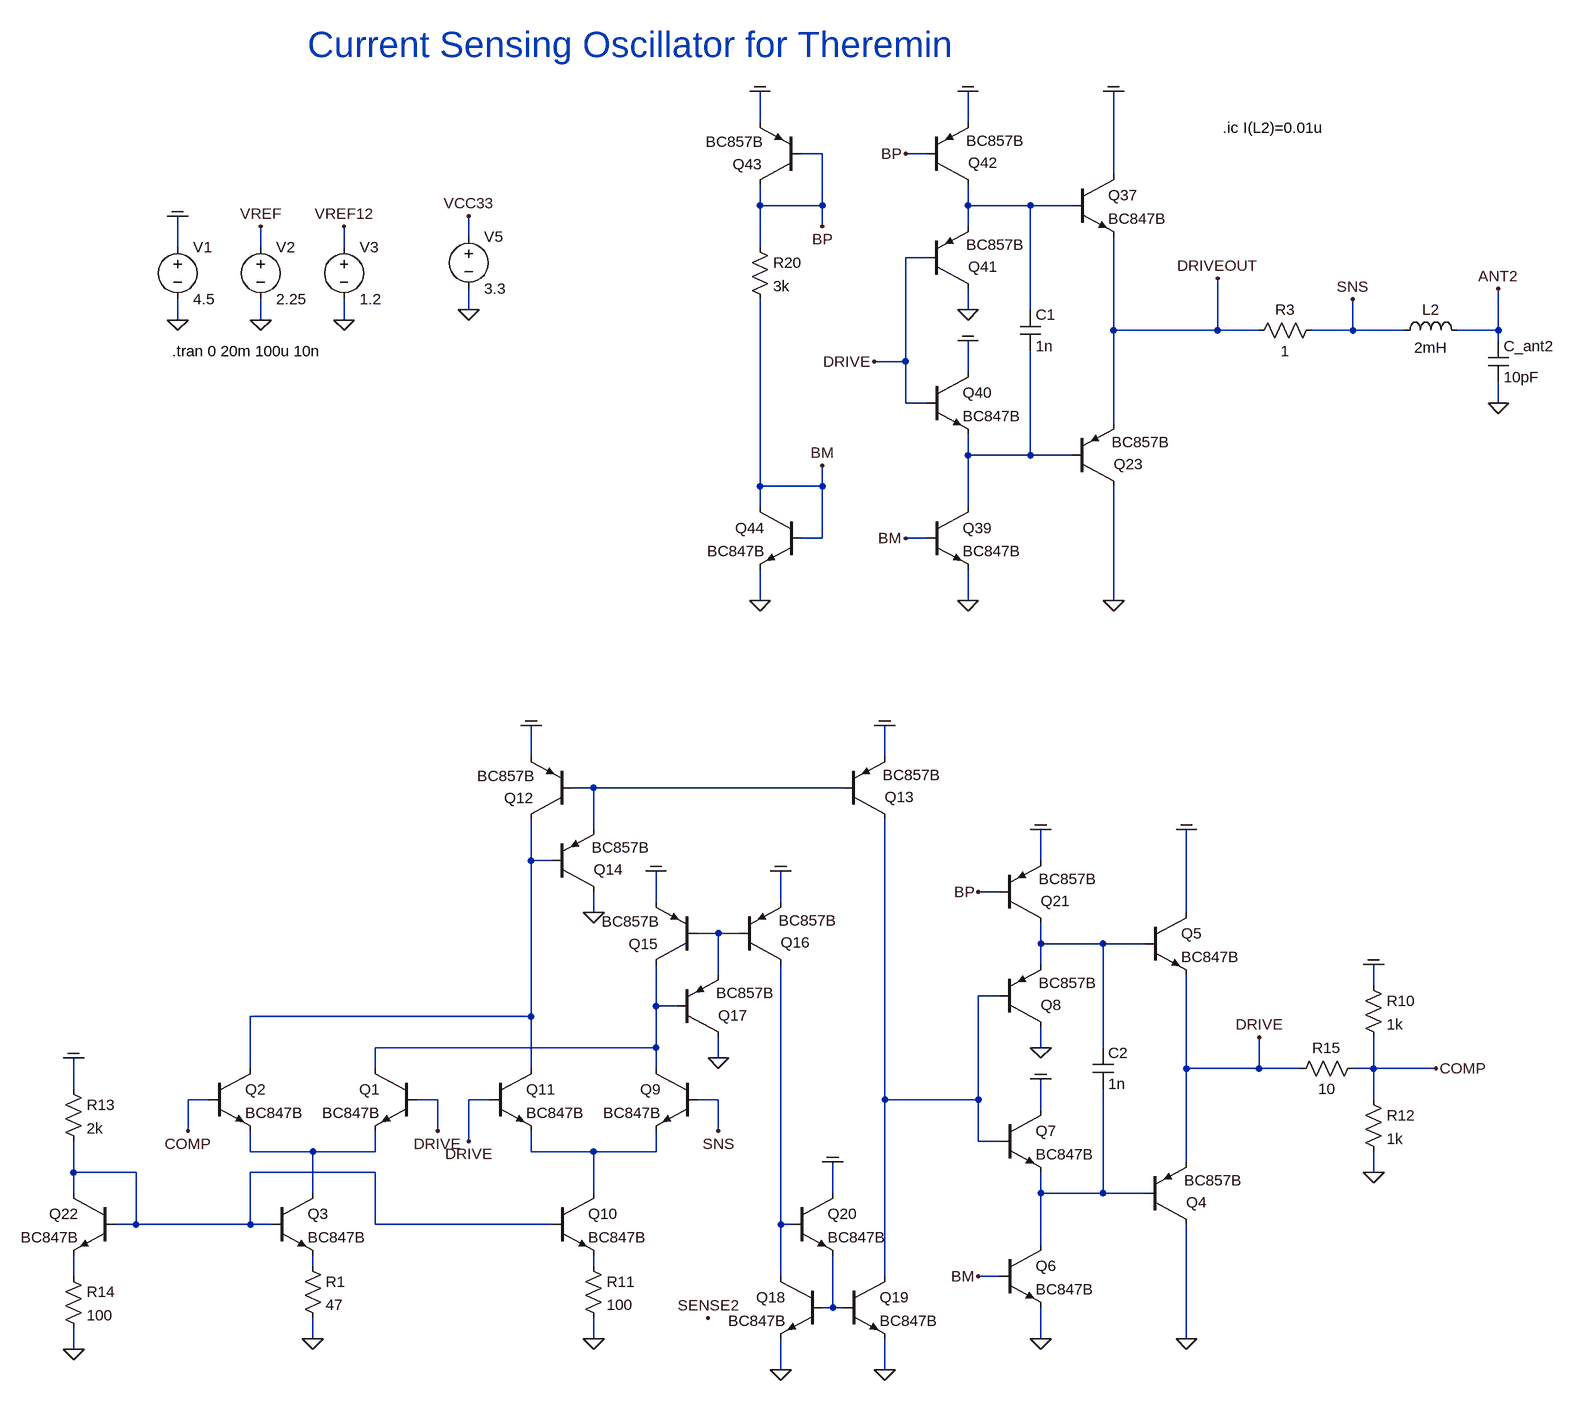
[diagram p0: schematic current_sensing_osc_v01.asc]
current_sensing_osc_v01.asc, the LTspice schematic file:
Version 4
SHEET 1 4012 2536
WIRE 1456 -160 1456 -208
WIRE 1776 -160 1776 -208
WIRE 1552 -112 1520 -112
WIRE 1712 -112 1680 -112
WIRE 2000 -80 2000 -208
WIRE 1456 -32 1456 -64
WIRE 1552 -32 1552 -112
WIRE 1552 -32 1456 -32
WIRE 1776 -32 1776 -64
WIRE 1872 -32 1776 -32
WIRE 1936 -32 1872 -32
WIRE 1552 0 1552 -32
WIRE 1776 0 1776 -32
WIRE 1008 16 1008 -16
WIRE 560 32 560 -16
WIRE 688 32 688 0
WIRE 816 32 816 0
WIRE 1456 32 1456 -32
WIRE 1712 48 1680 48
WIRE 1008 128 1008 96
WIRE 1776 128 1776 96
WIRE 1872 128 1872 -32
WIRE 560 144 560 112
WIRE 688 144 688 112
WIRE 816 144 816 112
WIRE 2000 160 2000 16
WIRE 2160 160 2160 80
WIRE 2160 160 2000 160
WIRE 2224 160 2160 160
WIRE 2368 160 2368 112
WIRE 2368 160 2304 160
WIRE 2448 160 2368 160
WIRE 2592 160 2592 96
WIRE 2592 160 2528 160
WIRE 2592 176 2592 160
WIRE 1680 208 1680 48
WIRE 1680 208 1632 208
WIRE 1776 224 1776 176
WIRE 1680 272 1680 208
WIRE 1712 272 1680 272
WIRE 2592 272 2592 240
WIRE 2000 304 2000 160
WIRE 1776 352 1776 320
WIRE 1872 352 1872 192
WIRE 1872 352 1776 352
WIRE 1936 352 1872 352
WIRE 1456 400 1456 112
WIRE 1552 400 1552 368
WIRE 1552 400 1456 400
WIRE 1456 432 1456 400
WIRE 1776 432 1776 352
WIRE 1552 480 1552 400
WIRE 1552 480 1520 480
WIRE 1712 480 1680 480
WIRE 1456 576 1456 528
WIRE 1776 576 1776 528
WIRE 2000 576 2000 400
WIRE 1104 816 1104 768
WIRE 1648 816 1648 768
WIRE 1200 864 1168 864
WIRE 1584 864 1200 864
WIRE 1200 928 1200 864
WIRE 1104 976 1104 912
WIRE 1136 976 1104 976
WIRE 1888 976 1888 928
WIRE 1824 1024 1792 1024
WIRE 1296 1040 1296 992
WIRE 1488 1040 1488 992
WIRE 1200 1056 1200 1024
WIRE 2112 1056 2112 928
WIRE 1392 1088 1360 1088
WIRE 1424 1088 1392 1088
WIRE 1888 1104 1888 1072
WIRE 1984 1104 1888 1104
WIRE 2048 1104 1984 1104
WIRE 1888 1136 1888 1104
WIRE 1392 1152 1392 1088
WIRE 2400 1168 2400 1136
WIRE 1824 1184 1792 1184
WIRE 1296 1200 1296 1136
WIRE 1328 1200 1296 1200
WIRE 1104 1216 1104 976
WIRE 1104 1216 672 1216
WIRE 1296 1264 1296 1200
WIRE 1296 1264 864 1264
WIRE 1888 1264 1888 1232
WIRE 1984 1264 1984 1104
WIRE 1392 1280 1392 1248
WIRE 672 1296 672 1216
WIRE 864 1296 864 1264
WIRE 1104 1296 1104 1216
WIRE 1296 1296 1296 1264
WIRE 2112 1296 2112 1152
WIRE 2224 1296 2224 1248
WIRE 2224 1296 2112 1296
WIRE 2288 1296 2224 1296
WIRE 2400 1296 2400 1248
WIRE 2400 1296 2368 1296
WIRE 2496 1296 2400 1296
WIRE 400 1328 400 1280
WIRE 608 1344 576 1344
WIRE 960 1344 928 1344
WIRE 1040 1344 1008 1344
WIRE 1392 1344 1360 1344
WIRE 1648 1344 1648 912
WIRE 1792 1344 1792 1184
WIRE 1792 1344 1648 1344
WIRE 2400 1344 2400 1296
WIRE 1888 1360 1888 1312
WIRE 576 1392 576 1344
WIRE 960 1392 960 1344
WIRE 1392 1392 1392 1344
WIRE 1008 1408 1008 1344
WIRE 1792 1408 1792 1344
WIRE 1824 1408 1792 1408
WIRE 672 1424 672 1392
WIRE 768 1424 672 1424
WIRE 864 1424 864 1392
WIRE 864 1424 768 1424
WIRE 1104 1424 1104 1392
WIRE 1200 1424 1104 1424
WIRE 1296 1424 1296 1392
WIRE 1296 1424 1200 1424
WIRE 2112 1440 2112 1296
WIRE 400 1456 400 1408
WIRE 496 1456 400 1456
WIRE 864 1456 672 1456
WIRE 2400 1456 2400 1424
WIRE 400 1488 400 1456
WIRE 768 1488 768 1424
WIRE 1200 1488 1200 1424
WIRE 1568 1488 1568 1440
WIRE 1888 1488 1888 1456
WIRE 1984 1488 1984 1328
WIRE 1984 1488 1888 1488
WIRE 2048 1488 1984 1488
WIRE 496 1536 496 1456
WIRE 496 1536 464 1536
WIRE 672 1536 672 1456
WIRE 672 1536 496 1536
WIRE 704 1536 672 1536
WIRE 864 1536 864 1456
WIRE 1136 1536 864 1536
WIRE 1488 1536 1488 1136
WIRE 1504 1536 1488 1536
WIRE 1888 1568 1888 1488
WIRE 768 1600 768 1584
WIRE 1200 1600 1200 1584
WIRE 400 1616 400 1584
WIRE 1488 1616 1488 1536
WIRE 1648 1616 1648 1344
WIRE 1824 1616 1792 1616
WIRE 1568 1664 1568 1584
WIRE 1568 1664 1552 1664
WIRE 1584 1664 1568 1664
WIRE 768 1712 768 1680
WIRE 1200 1712 1200 1680
WIRE 1888 1712 1888 1664
WIRE 2112 1712 2112 1536
WIRE 400 1728 400 1696
WIRE 1488 1760 1488 1712
WIRE 1648 1760 1648 1712
FLAG 560 144 0
FLAG 560 -16 COM
FLAG 688 144 0
FLAG 688 0 VREF
FLAG 816 144 0
FLAG 816 0 VREF12
FLAG 1392 1392 SNS
FLAG 1200 1712 0
FLAG 1376 1680 SENSE2
FLAG 1104 768 COM
FLAG 1648 768 COM
FLAG 1200 1056 0
FLAG 1296 992 COM
FLAG 1488 992 COM
FLAG 1392 1280 0
FLAG 1488 1760 0
FLAG 1648 1760 0
FLAG 1008 1408 DRIVE
FLAG 400 1280 COM
FLAG 400 1728 0
FLAG 960 1392 DRIVE
FLAG 576 1392 COMP
FLAG 768 1712 0
FLAG 1008 128 0
FLAG 1008 -16 VCC33
FLAG 2224 1248 DRIVE
FLAG 2400 1136 COM
FLAG 2400 1456 0
FLAG 2496 1296 COMP
FLAG 1568 1440 COM
FLAG 1776 576 0
FLAG 1776 176 COM
FLAG 1776 128 0
FLAG 1776 -208 COM
FLAG 1456 -208 COM
FLAG 1456 576 0
FLAG 2592 272 0
FLAG 2592 96 ANT2
FLAG 1632 208 DRIVE
FLAG 2368 112 SNS
FLAG 1552 368 BM
FLAG 1552 0 BP
FLAG 2000 576 0
FLAG 2000 -208 COM
FLAG 1680 480 BM
FLAG 1680 -112 BP
FLAG 1888 1712 0
FLAG 1888 1312 COM
FLAG 1888 1264 0
FLAG 1888 928 COM
FLAG 2112 1712 0
FLAG 2112 928 COM
FLAG 1792 1616 BM
FLAG 1792 1024 BP
FLAG 2160 80 DRIVEOUT
SYMBOL voltage 560 16 R0
SYMATTR InstName V1
SYMATTR Value 4.5
SYMBOL Voltage 688 16 R0
SYMATTR InstName V2
SYMATTR Value 2.25
SYMBOL Voltage 816 16 R0
SYMATTR InstName V3
SYMATTR Value 1.2
SYMBOL npn 1360 1296 M0
SYMATTR InstName Q9
SYMATTR Value BC847B
SYMBOL npn 1136 1488 R0
SYMATTR InstName Q10
SYMATTR Value BC847B
SYMBOL Res 1184 1584 R0
SYMATTR InstName R11
SYMATTR Value 100
SYMBOL npn 1040 1296 R0
SYMATTR InstName Q11
SYMATTR Value BC847B
SYMBOL pnp 1168 912 R180
WINDOW 0 60 32 Left 2
WINDOW 3 58 66 Left 2
SYMATTR InstName Q12
SYMATTR Value BC857B
SYMBOL pnp 1584 912 M180
WINDOW 0 64 34 Left 2
WINDOW 3 61 68 Left 2
SYMATTR InstName Q13
SYMATTR Value BC857B
SYMBOL pnp 1136 1024 M180
WINDOW 0 64 34 Left 2
WINDOW 3 61 68 Left 2
SYMATTR InstName Q14
SYMATTR Value BC857B
SYMBOL pnp 1360 1136 R180
WINDOW 0 60 32 Left 2
WINDOW 3 58 66 Left 2
SYMATTR InstName Q15
SYMATTR Value BC857B
SYMBOL pnp 1424 1136 M180
WINDOW 0 64 34 Left 2
WINDOW 3 61 68 Left 2
SYMATTR InstName Q16
SYMATTR Value BC857B
SYMBOL pnp 1328 1248 M180
WINDOW 0 64 34 Left 2
WINDOW 3 61 68 Left 2
SYMATTR InstName Q17
SYMATTR Value BC857B
SYMBOL npn 1552 1616 M0
SYMATTR InstName Q18
SYMATTR Value BC847B
SYMBOL npn 1584 1616 R0
SYMATTR InstName Q19
SYMATTR Value BC847B
SYMBOL Res 384 1312 R0
SYMATTR InstName R13
SYMATTR Value 2k
SYMBOL npn 464 1488 M0
SYMATTR InstName Q22
SYMATTR Value BC847B
SYMBOL Res 384 1600 R0
SYMATTR InstName R14
SYMATTR Value 100
SYMBOL npn 928 1296 M0
SYMATTR InstName Q1
SYMATTR Value BC847B
SYMBOL npn 608 1296 R0
SYMATTR InstName Q2
SYMATTR Value BC847B
SYMBOL npn 704 1488 R0
SYMATTR InstName Q3
SYMATTR Value BC847B
SYMBOL Res 752 1584 R0
SYMATTR InstName R1
SYMATTR Value 47
SYMBOL Voltage 1008 0 R0
SYMATTR InstName V5
SYMATTR Value 3.3
SYMBOL Res 2384 1152 R0
SYMATTR InstName R10
SYMATTR Value 1k
SYMBOL Res 2384 1328 R0
SYMATTR InstName R12
SYMATTR Value 1k
SYMBOL Res 2384 1280 R90
WINDOW 0 0 56 VBottom 2
WINDOW 3 32 56 VTop 2
SYMATTR InstName R15
SYMATTR Value 10
SYMBOL npn 1504 1488 R0
SYMATTR InstName Q20
SYMATTR Value BC847B
SYMBOL pnp 1936 400 M180
WINDOW 0 64 34 Left 2
WINDOW 3 61 68 Left 2
SYMATTR InstName Q23
SYMATTR Value BC857B
SYMBOL npn 1936 -80 R0
SYMATTR InstName Q37
SYMATTR Value BC847B
SYMBOL npn 1712 432 R0
SYMATTR InstName Q39
SYMATTR Value BC847B
SYMBOL npn 1712 224 R0
SYMATTR InstName Q40
SYMATTR Value BC847B
SYMBOL pnp 1712 96 M180
WINDOW 0 64 34 Left 2
WINDOW 3 61 68 Left 2
SYMATTR InstName Q41
SYMATTR Value BC857B
SYMBOL pnp 1712 -64 M180
WINDOW 0 64 34 Left 2
WINDOW 3 61 68 Left 2
SYMATTR InstName Q42
SYMATTR Value BC857B
SYMBOL pnp 1520 -64 R180
WINDOW 0 60 32 Left 2
WINDOW 3 58 66 Left 2
SYMATTR InstName Q43
SYMATTR Value BC857B
SYMBOL npn 1520 432 M0
SYMATTR InstName Q44
SYMATTR Value BC847B
SYMBOL Res 1440 16 R0
SYMATTR InstName R20
SYMATTR Value 3k
SYMBOL ind 2432 176 R270
WINDOW 0 32 56 VTop 2
WINDOW 3 5 56 VBottom 2
SYMATTR InstName L2
SYMATTR Value 2mH
SYMATTR SpiceLine Rser=120 Cpar=1pF
SYMBOL Cap 2576 176 R0
SYMATTR InstName C_ant2
SYMATTR Value 10pF
SYMBOL Cap 1856 128 R0
SYMATTR InstName C1
SYMATTR Value 1n
SYMBOL pnp 2048 1536 M180
WINDOW 0 64 34 Left 2
WINDOW 3 61 68 Left 2
SYMATTR InstName Q4
SYMATTR Value BC857B
SYMBOL npn 2048 1056 R0
SYMATTR InstName Q5
SYMATTR Value BC847B
SYMBOL npn 1824 1568 R0
SYMATTR InstName Q6
SYMATTR Value BC847B
SYMBOL npn 1824 1360 R0
SYMATTR InstName Q7
SYMATTR Value BC847B
SYMBOL pnp 1824 1232 M180
WINDOW 0 64 34 Left 2
WINDOW 3 61 68 Left 2
SYMATTR InstName Q8
SYMATTR Value BC857B
SYMBOL pnp 1824 1072 M180
WINDOW 0 64 34 Left 2
WINDOW 3 61 68 Left 2
SYMATTR InstName Q21
SYMATTR Value BC857B
SYMBOL Cap 1968 1264 R0
SYMATTR InstName C2
SYMATTR Value 1n
SYMBOL Res 2320 144 R90
WINDOW 0 0 56 VBottom 2
WINDOW 3 32 56 VTop 2
SYMATTR InstName R3
SYMATTR Value 1
TEXT 552 192 Left 2 !.tran 0 20m 100u 10n
TEXT 2168 -152 Left 2 !.ic I(L2)=0.01u
TEXT 760 -280 Left 5 ;Current Sensing Oscillator for Theremin

The netlist it stands for:
* current_sensing_osc_v01.asc
V1 COM 0 4.5
V2 VREF 0 2.25
V3 VREF12 0 1.2
Q9 N008 SNS N010 0 BC847B
Q10 N010 N011 N015 0 BC847B
R11 N015 0 100
Q11 N004 DRIVE N010 0 BC847B
Q12 N004 N003 COM 0 BC857B
Q13 N007 N003 COM 0 BC857B
Q14 0 N004 N003 0 BC857B
Q15 N008 N005 COM 0 BC857B
Q16 N013 N005 COM 0 BC857B
Q17 0 N008 N005 0 BC857B
Q18 N013 N017 0 0 BC847B
Q19 N007 N017 0 0 BC847B
R13 COM N011 2k
Q22 N011 N011 N016 0 BC847B
R14 N016 0 100
Q1 N008 DRIVE N009 0 BC847B
Q2 N004 COMP N009 0 BC847B
Q3 N009 N011 N014 0 BC847B
R1 N014 0 47
V5 VCC33 0 3.3
R10 COM COMP 1k
R12 COMP 0 1k
R15 COMP DRIVE 10
Q20 COM N013 N017 0 BC847B
Q23 0 N002 DRIVEOUT 0 BC857B
Q37 COM N001 DRIVEOUT 0 BC847B
Q39 N002 BM 0 0 BC847B
Q40 COM DRIVE N002 0 BC847B
Q41 0 DRIVE N001 0 BC857B
Q42 N001 BP COM 0 BC857B
Q43 BP BP COM 0 BC857B
Q44 BM BM 0 0 BC847B
R20 BP BM 3k
L2 SNS ANT2 2mH Rser=120 Cpar=1pF
C_ant2 ANT2 0 10pF
C1 N001 N002 1n
Q4 0 N012 DRIVE 0 BC857B
Q5 COM N006 DRIVE 0 BC847B
Q6 N012 BM 0 0 BC847B
Q7 COM N007 N012 0 BC847B
Q8 0 N007 N006 0 BC857B
Q21 N006 BP COM 0 BC857B
C2 N006 N012 1n
R3 SNS DRIVEOUT 1
.model NPN NPN
.model PNP PNP
.lib standard.bjt
.tran 0 20m 100u 10n
.ic I(L2)=0.01u
* Current Sensing Oscillator for Theremin
.backanno
.end